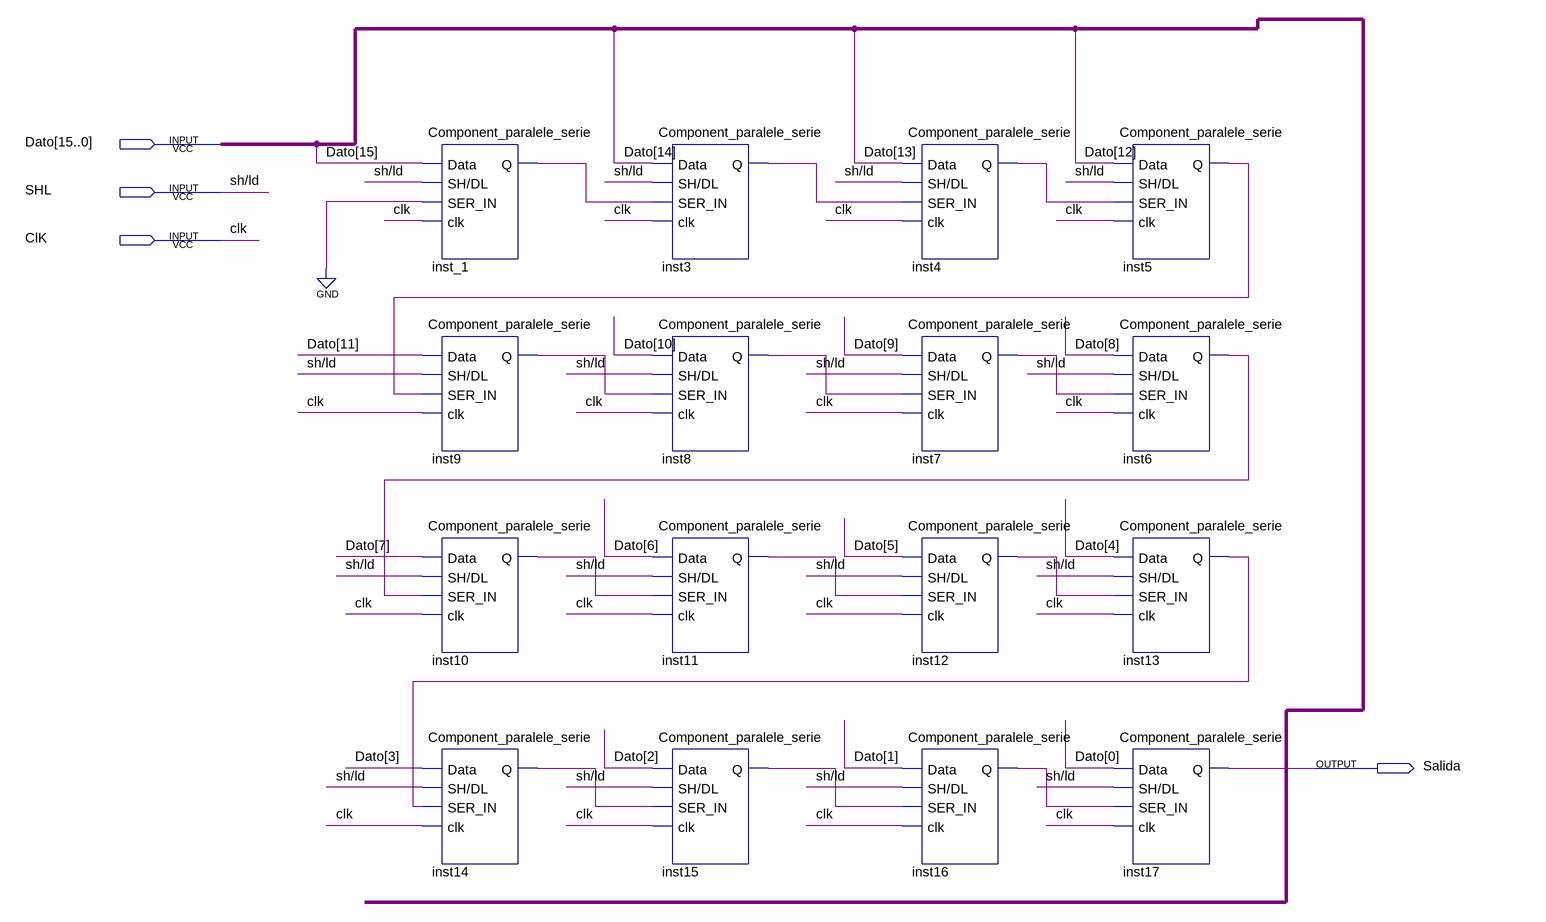
[diagram p0: schematic sheet]
// Quartus schematic Paralele_serie_16bits.bdf as structural Verilog: 16 symbols, 4 pins
module Paralele_serie_16bits (
  input  [15:0] Dato,
  input  SHL,
  input  ClK,
  output Salida
);

  wire inst3_q, inst4_q, inst5_q, inst6_q, inst7_q, inst8_q, inst9_q, inst10_q, inst11_q, inst12_q, inst13_q,
       inst14_q, inst15_q, inst16_q, inst_1_q;

  Component_paralele_serie inst_1 (.Data(Dato[15]), .\SH/DL (SHL), .SER_IN(1'b0), .clk(ClK), .Q(inst_1_q));
  Component_paralele_serie inst9 (.Data(Dato[11]), .\SH/DL (SHL), .SER_IN(inst5_q), .clk(ClK), .Q(inst9_q));
  Component_paralele_serie inst10 (.Data(Dato[7]), .\SH/DL (SHL), .SER_IN(inst6_q), .clk(ClK), .Q(inst10_q));
  Component_paralele_serie inst14 (.Data(Dato[3]), .\SH/DL (SHL), .SER_IN(inst13_q), .clk(ClK), .Q(inst14_q));
  Component_paralele_serie inst3 (.Data(Dato[14]), .\SH/DL (SHL), .SER_IN(inst_1_q), .clk(ClK), .Q(inst3_q));
  Component_paralele_serie inst8 (.Data(Dato[10]), .\SH/DL (SHL), .SER_IN(inst9_q), .clk(ClK), .Q(inst8_q));
  Component_paralele_serie inst11 (.Data(Dato[6]), .\SH/DL (SHL), .SER_IN(inst10_q), .clk(ClK), .Q(inst11_q));
  Component_paralele_serie inst15 (.Data(Dato[2]), .\SH/DL (SHL), .SER_IN(inst14_q), .clk(ClK), .Q(inst15_q));
  Component_paralele_serie inst4 (.Data(Dato[13]), .\SH/DL (SHL), .SER_IN(inst3_q), .clk(ClK), .Q(inst4_q));
  Component_paralele_serie inst7 (.Data(Dato[9]), .\SH/DL (SHL), .SER_IN(inst8_q), .clk(ClK), .Q(inst7_q));
  Component_paralele_serie inst12 (.Data(Dato[5]), .\SH/DL (SHL), .SER_IN(inst11_q), .clk(ClK), .Q(inst12_q));
  Component_paralele_serie inst16 (.Data(Dato[1]), .\SH/DL (SHL), .SER_IN(inst15_q), .clk(ClK), .Q(inst16_q));
  Component_paralele_serie inst5 (.Data(Dato[12]), .\SH/DL (SHL), .SER_IN(inst4_q), .clk(ClK), .Q(inst5_q));
  Component_paralele_serie inst6 (.Data(Dato[8]), .\SH/DL (SHL), .SER_IN(inst7_q), .clk(ClK), .Q(inst6_q));
  Component_paralele_serie inst13 (.Data(Dato[4]), .\SH/DL (SHL), .SER_IN(inst12_q), .clk(ClK), .Q(inst13_q));
  Component_paralele_serie inst17 (.Data(Dato[0]), .\SH/DL (SHL), .SER_IN(inst16_q), .clk(ClK), .Q(Salida));

  // Other names for the same wires on the sheet: sh/ld = SHL
endmodule
